# Altium schematic sheet STAC_Test_Board_v1_Digital.SchDoc
size C; SheetNumber: 3; SheetTotal: 3
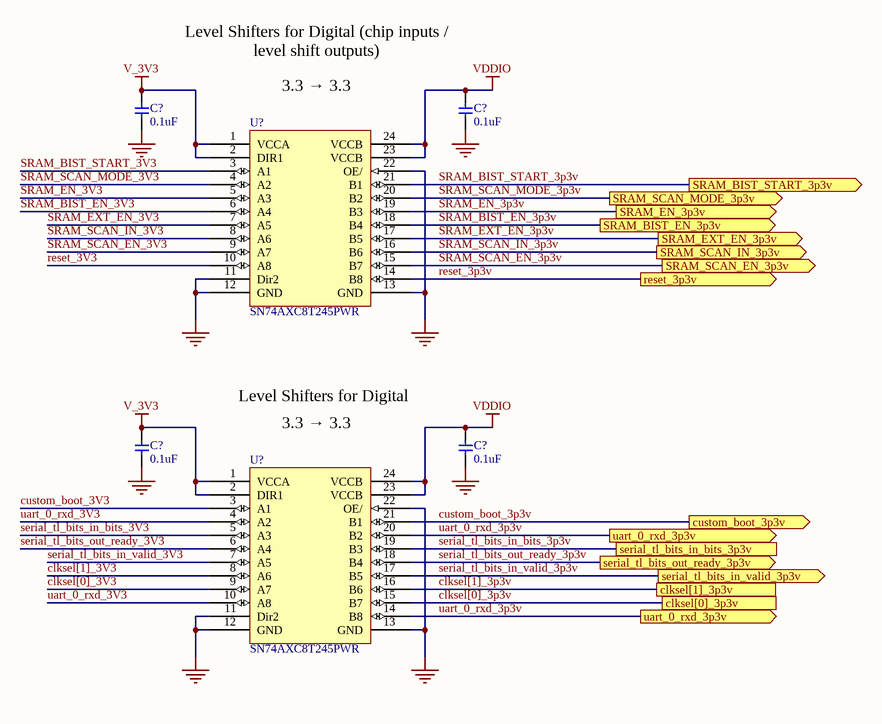
[diagram p0: STAC_Test_Board_v1_Digital.SchDoc]

## Parts
(Parts that share a designator on the sheet are numbered #1, #2 ... from top to bottom, then left to right.)
C?#1  0.1uF  [0603]
C?#2  0.1uF  [0603]
C?#3  0.1uF  [0603]
C?#4  0.1uF  [0603]
U?#1  SN74AXC8T245PWR  [GW-24-.65-6.4]
U?#2  SN74AXC8T245PWR  [GW-24-.65-6.4]

## Ports
clksel[0]_3p3v, clksel[1]_3p3v, custom_boot_3p3v (out), reset_3p3v (out), serial_tl_bits_in_bits_3p3v, serial_tl_bits_in_valid_3p3v (out), serial_tl_bits_out_ready_3p3v (out), SRAM_BIST_EN_3p3v (out), SRAM_BIST_START_3p3v (out), SRAM_EN_3p3v (out), SRAM_EXT_EN_3p3v (out), SRAM_SCAN_EN_3p3v (out), SRAM_SCAN_IN_3p3v (out), SRAM_SCAN_MODE_3p3v (out), uart_0_rxd_3p3v (out)

## Nets
GND: C?#1.2 C?#2.2 C?#3.2 C?#4.2 U?#1.11(Dir2) U?#1.12(GND) U?#1.13(GND) U?#1.22(OE/) U?#2.11(Dir2) U?#2.12(GND) U?#2.13(GND) U?#2.22(OE/)
V_3V3: C?#1.1 C?#3.1 U?#1.1(VCCA) U?#1.2(DIR1) U?#2.1(VCCA) U?#2.2(DIR1)
VDDIO: C?#2.1 C?#4.1 U?#1.23(VCCB) U?#1.24(VCCB) U?#2.23(VCCB) U?#2.24(VCCB)
clksel[0]_3p3v: U?#2.15(B7) ; port clksel[0]_3p3v
clksel[0]_3V3: U?#2.9(A7)
clksel[1]_3p3v: U?#2.16(B6) ; port clksel[1]_3p3v
clksel[1]_3V3: U?#2.8(A6)
custom_boot_3p3v: U?#2.21(B1) ; port custom_boot_3p3v
custom_boot_3V3: U?#2.3(A1)
reset_3p3v: U?#1.14(B8) ; port reset_3p3v
reset_3V3: U?#1.10(A8)
serial_tl_bits_in_bits_3p3v: U?#2.19(B3) ; port serial_tl_bits_in_bits_3p3v
serial_tl_bits_in_bits_3V3: U?#2.5(A3)
serial_tl_bits_in_valid_3p3v: U?#2.17(B5) ; port serial_tl_bits_in_valid_3p3v
serial_tl_bits_in_valid_3V3: U?#2.7(A5)
serial_tl_bits_out_ready_3p3v: U?#2.18(B4) ; port serial_tl_bits_out_ready_3p3v
serial_tl_bits_out_ready_3V3: U?#2.6(A4)
SRAM_BIST_EN_3p3v: U?#1.18(B4) ; port SRAM_BIST_EN_3p3v
SRAM_BIST_EN_3V3: U?#1.6(A4)
SRAM_BIST_START_3p3v: U?#1.21(B1) ; port SRAM_BIST_START_3p3v
SRAM_BIST_START_3V3: U?#1.3(A1)
SRAM_EN_3p3v: U?#1.19(B3) ; port SRAM_EN_3p3v
SRAM_EN_3V3: U?#1.5(A3)
SRAM_EXT_EN_3p3v: U?#1.17(B5) ; port SRAM_EXT_EN_3p3v
SRAM_EXT_EN_3V3: U?#1.7(A5)
SRAM_SCAN_EN_3p3v: U?#1.15(B7) ; port SRAM_SCAN_EN_3p3v
SRAM_SCAN_EN_3V3: U?#1.9(A7)
SRAM_SCAN_IN_3p3v: U?#1.16(B6) ; port SRAM_SCAN_IN_3p3v
SRAM_SCAN_IN_3V3: U?#1.8(A6)
SRAM_SCAN_MODE_3p3v: U?#1.20(B2) ; port SRAM_SCAN_MODE_3p3v
SRAM_SCAN_MODE_3V3: U?#1.4(A2)
uart_0_rxd_3p3v: U?#2.14(B8) U?#2.20(B2) ; port uart_0_rxd_3p3v
uart_0_rxd_3V3: U?#2.4(A2) U?#2.10(A8)

## Notes on the sheet
- (near C?#2) Level Shifters for Digital (chip inputs / level shift outputs)
- (near U?#1) 3.3 → 3.3
- Level Shifters for Digital
- (near U?#2) 3.3 → 3.3

## Library data of the parts
C?#1-C?#4 = DISCRETE_C: Capacitor generic
U?#1 U?#2 = IC_SN74AXC8T245: SN74AXC8T245 level shifter 8-ch unidirectional